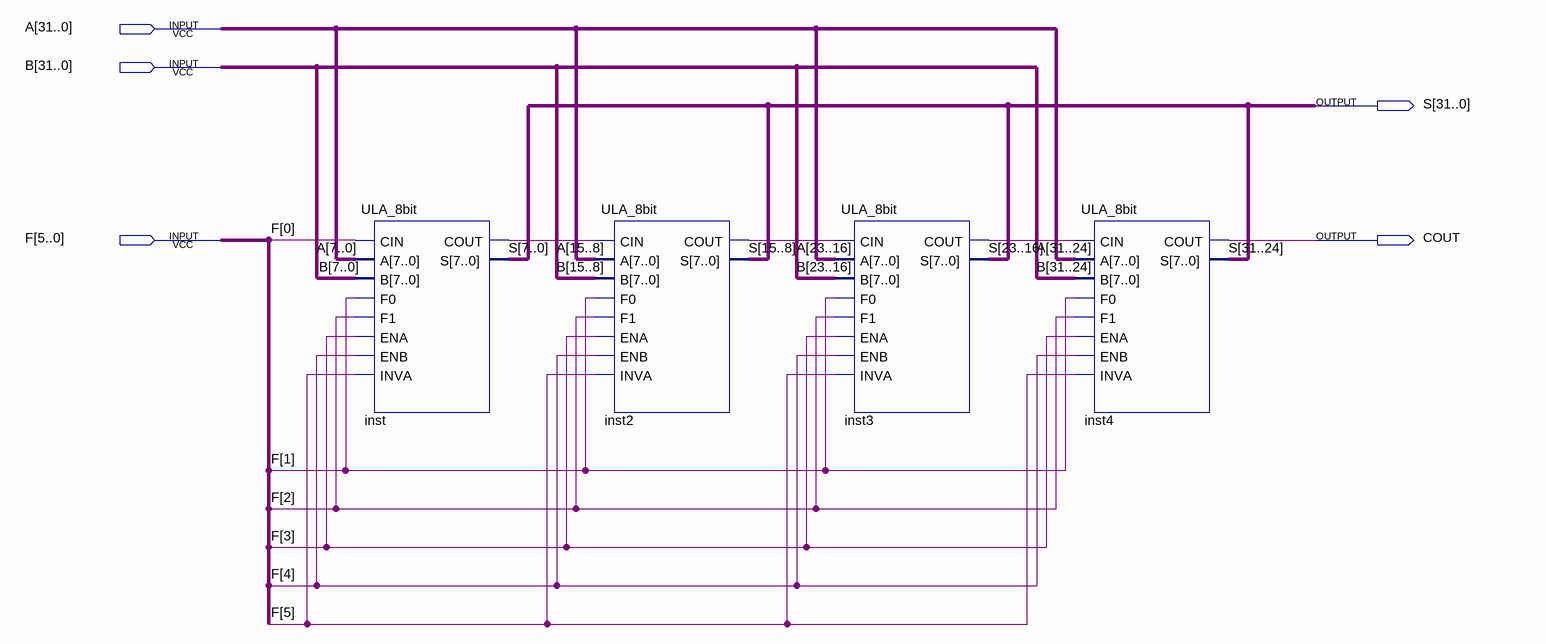
[diagram p0: schematic sheet]
// Quartus schematic ULA_32bit.bdf as structural Verilog: 4 symbols, 5 pins
module ULA_32bit (
  input  [31:0] A,
  input  [31:0] B,
  input  [5:0] F,
  output [31:0] S,
  output COUT
);

  wire inst2_cout, inst3_cout, inst_cout;

  ULA_8bit inst (
    .A(A[7:0]), .B(B[7:0]), .CIN(F[0]), .F0(F[1]), .F1(F[2]), .ENA(F[3]), .ENB(F[4]), .INVA(F[5]),
    .S(S[7:0]), .COUT(inst_cout));
  ULA_8bit inst2 (
    .A(A[15:8]), .B(B[15:8]), .CIN(inst_cout), .F0(F[1]), .F1(F[2]), .ENA(F[3]), .ENB(F[4]), .INVA(F[5]),
    .S(S[15:8]), .COUT(inst2_cout));
  ULA_8bit inst3 (
    .A(A[23:16]), .B(B[23:16]), .CIN(inst2_cout), .F0(F[1]), .F1(F[2]), .ENA(F[3]), .ENB(F[4]), .INVA(F[5]),
    .S(S[23:16]), .COUT(inst3_cout));
  ULA_8bit inst4 (
    .A(A[31:24]), .B(B[31:24]), .CIN(inst3_cout), .F0(F[1]), .F1(F[2]), .ENA(F[3]), .ENB(F[4]), .INVA(F[5]),
    .S(S[31:24]), .COUT(COUT));
endmodule
